# Altium schematic sheet ATmega8_DIP.SchDoc
size 160 x 71 mm
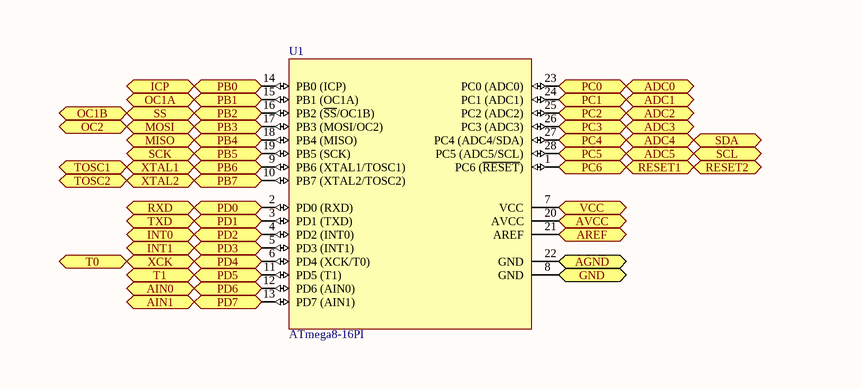
[diagram p0: ATmega8_DIP.SchDoc]

## Parts
U1  ATmega8-16PI  [28P3]

## Ports
ADC0 (in), ADC1 (in), ADC2 (in), ADC3 (in), ADC4 (in), ADC5 (in), AGND (in), AIN0 (bidir), AIN1 (bidir), AREF (in), AVCC (in), GND (in), ICP (bidir), INT0 (in), INT1 (in), MISO (bidir), MOSI (bidir), OC1A (out), OC1B (out), OC2 (bidir), PB0, PB1, PB2, PB3, PB4, PB5, PB6, PB7, PC0 (bidir), PC1 (bidir), PC2 (bidir), PC3 (bidir), PC4 (bidir), PC5 (bidir), PC6 (bidir), PD0, PD1, PD2, PD3, PD4, PD5, PD6, PD7, RESET1 (in), RESET2 (in), RXD (bidir), SCK (bidir), SCL (bidir), SDA (bidir), SS (bidir), T0 (bidir), T1 (bidir), TOSC1 (bidir), TOSC2 (bidir), TXD (bidir), VCC (in), XCK (bidir), XTAL1 (in), XTAL2 (in)

## Nets
ADC0: U1.23(PC0_(ADC0)) ; port PC0, port ADC0
ADC1: U1.24(PC1_(ADC1)) ; port PC1, port ADC1
ADC2: U1.25(PC2_(ADC2)) ; port PC2, port ADC2
ADC3: U1.26(PC3_(ADC3)) ; port PC3, port ADC3
ADC4: U1.27(PC4_(ADC4/SDA)) ; port PC4, port ADC4, port SDA
ADC5: U1.28(PC5_(ADC5/SCL)) ; port PC5, port ADC5, port SCL
AGND: U1.22(GND) ; port AGND
AIN0: U1.12(PD6_(AIN0)) ; port AIN0, port PD6
AIN1: U1.13(PD7_(AIN1)) ; port AIN1, port PD7
AREF: U1.21(AREF) ; port AREF
AVCC: U1.20(AVCC) ; port AVCC
GND: U1.8(GND) ; port GND
ICP: U1.14(PB0_(ICP)) ; port PB0, port ICP
INT0: U1.4(PD2_(INT0)) ; port PD2, port INT0
INT1: U1.5(PD3_(INT1)) ; port INT1, port PD3
MISO: U1.18(PB4_(MISO)) ; port MISO, port PB4
MOSI: U1.17(PB3_(MOSI/OC2)) ; port MOSI, port PB3, port OC2
OC1A: U1.15(PB1_(OC1A)) ; port PB1, port OC1A
OC1B: U1.16(PB2_(~{SS}/OC1B)) ; port PB2, port SS, port OC1B
PB5: U1.19(PB5_(SCK)) ; port PB5, port SCK
PB6: U1.9(PB6_(XTAL1/TOSC1)) ; port XTAL1, port PB6, port TOSC1
PB7: U1.10(PB7_(XTAL2/TOSC2)) ; port XTAL2, port PB7, port TOSC2
PC6: U1.1(PC6_(~{RESET})) ; port RESET1, port PC6, port RESET2
PD0: U1.2(PD0_(RXD)) ; port RXD, port PD0
PD1: U1.3(PD1_(TXD)) ; port TXD, port PD1
PD4: U1.6(PD4_(XCK/T0)) ; port XCK, port PD4, port T0
PD5: U1.11(PD5_(T1)) ; port T1, port PD5
VCC: U1.7(VCC) ; port VCC

## Library data of the parts
U1 = ATmega8-16PI: 8-Bit AVR Microcontroller with 8K Bytes of In-System Programmable Flash Memory; Published: 17-Sep-2003; DatasheetVersion: 2486H-AVR-09/02; PackageVersion: revB, Sep-2001; PackageReference: 28P3; Publisher: Altium Limited; PackageDescription: 28-lead (0.300"/7.62mm Wide) Plastic Dual Inline Package (PDIP); Supplier 1: Digi-Key; Supplier Part Number 1: ATMEGA8-16PI-ND; Supplier 2: Mouser; Supplier Part Number 2: 556-ATMEGA8-16PI; ComponentLink1Description: Datasheet; ComponentLink1URL: http://www.atmel.com/dyn/resources/prod_documents/doc2486.pdf; ComponentLink2Description: Atmel.com Home; ComponentLink2URL: http://www.atmel.com